# Altium schematic sheet Schematic (Altium).schdoc
size 129 x 75 mm
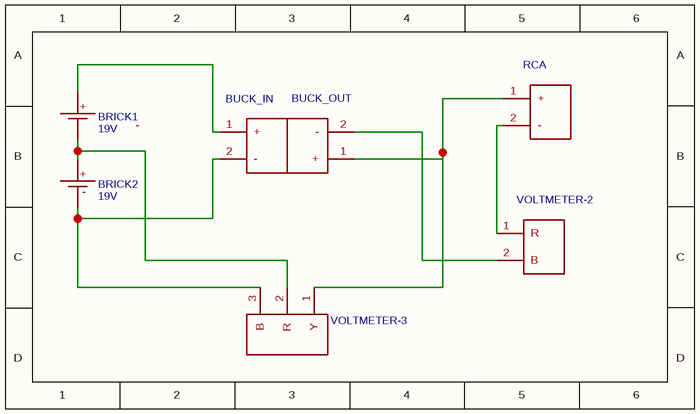
[diagram p0: Schematic (Altium).schdoc]

## Parts
BRICK1  19V  [MKDSN1.5/2-5.08]
BRICK2  19V  [MKDSN1.5/2-5.08]
BUCK_IN  MKDSN1.5/2-5.08  [CONN-TH_2P-P5.08]  (value not drawn)
BUCK_OUT  MKDSN1.5/2-5.08  [CONN-TH_2P-P5.08]  (value not drawn)
RCA  MKDSN1.5/2-5.08  [CONN-TH_2P-P5.08]  (value not drawn)
VOLTMETER-2  MKDSN1.5/2-5.08  [CONN-TH_2P-P5.08]  (value not drawn)
VOLTMETER-3  MKDSN1.5/3-5.08  [CONN-TH_3P-P5.08_1729131]  (value not drawn)

## Nets
NetBRICK1_1: BRICK1.1(+) BUCK_IN.1(+)
NetBRICK1_2: BRICK1.2(-) BRICK2.1(+) VOLTMETER-3.2(R)
NetBRICK2_2: BRICK2.2(-) BUCK_IN.2(-) VOLTMETER-3.3(B)
NetBUCK_OUT_1: BUCK_OUT.1(+) RCA.1(+) VOLTMETER-3.1(Y)
NetBUCK_OUT_2: BUCK_OUT.2(-) VOLTMETER-2.2(B)
NetRCA_2: RCA.2(-) VOLTMETER-2.1(R)

## Library data of the parts
BRICK1 BRICK2 = 19V: Contributor: adrejia; spicePre: U; spiceSymbolName: SOURCE DC
BUCK_IN BUCK_OUT RCA VOLTMETER-2 = MKDSN1.5/2-5.08: Manufacturer: Phoenix Contact(菲尼克斯); Manufacturer Part: 1729128; Supplier: LCSC; Supplier Part: C91153; JLCPCB Part Class: Extended Part; spicePre: C; spiceSymbolName: MKDSN1.5/2-5.08
VOLTMETER-3 = MKDSN1.5/3-5.08: Manufacturer: Phoenix Contact(菲尼克斯); Manufacturer Part: 1729131; Supplier: LCSC; Supplier Part: C91154; spicePre: C; spiceSymbolName: MKDSN1.5/3-5.08